# Altium schematic sheet 06 POWER.SchDoc: POWER
size 420 x 297 mm; SheetNumber: 6; SheetTotal: 6
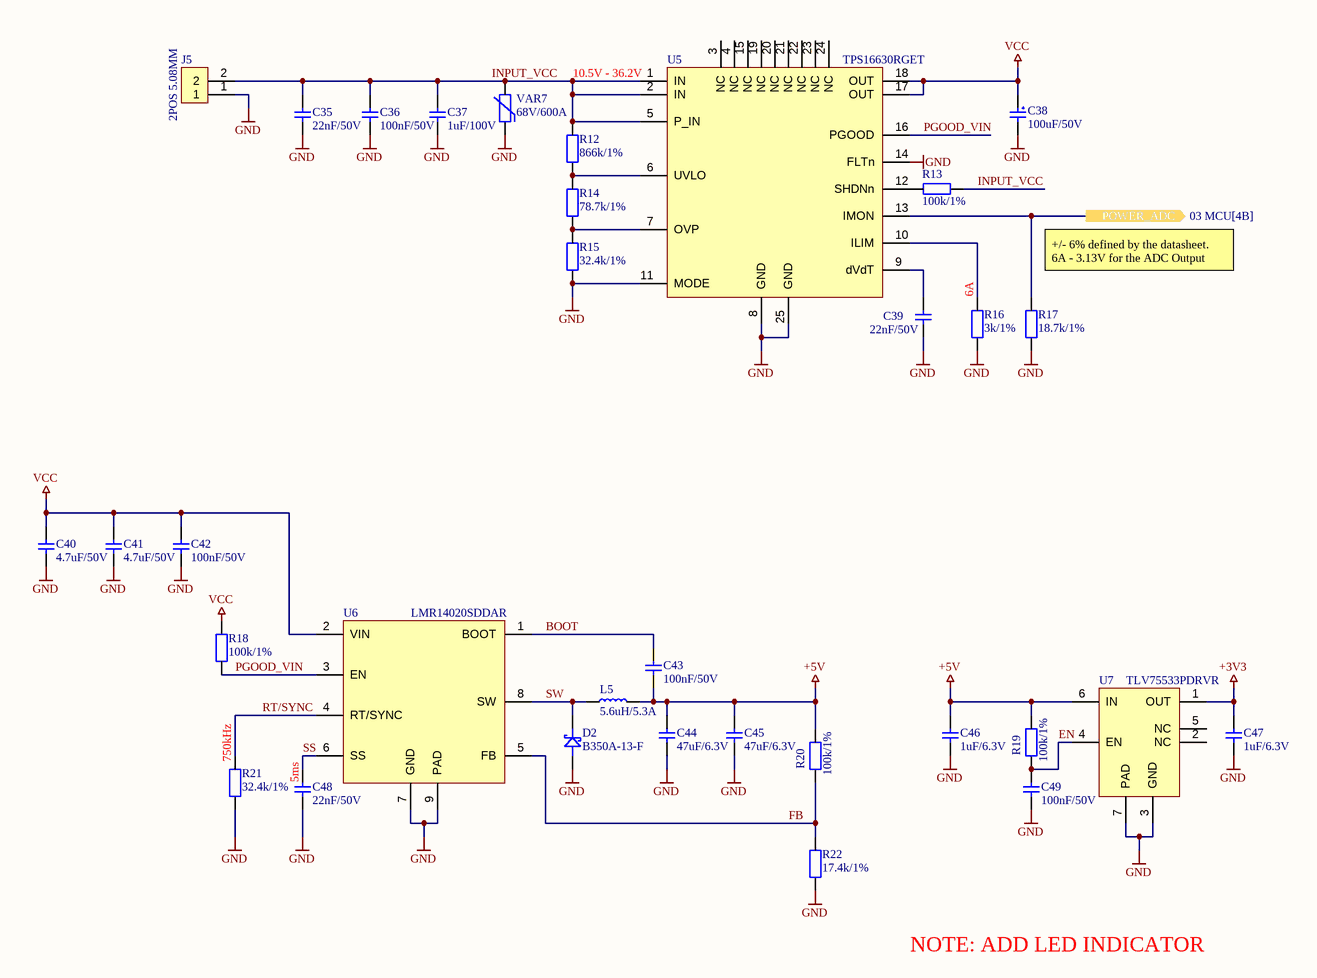
[diagram p0: 06 POWER.SchDoc]

## Parts
C35  22nF/50V  [CAPC1005X06M-0402]
C36  100nF/50V  [CAPC1005X06M-0402]
C37  1uF/100V  [CAPC2012X14M]
C38  100uF/50V  [A768KS107M1HLAE030]
C39  22nF/50V  [CAPC1005X06M-0402]
C40  4.7uF/50V  [CAPC2012X14M]
C41  4.7uF/50V  [CAPC2012X14M]
C42  100nF/50V  [CAPC1005X06M-0402]
C43  100nF/50V  [CAPC1005X06M-0402]
C44  47uF/6.3V  [CAPC1608X10M-0603]
C45  47uF/6.3V  [CAPC1608X10M-0603]
C46  1uF/6.3V  [CAPC1005X06M-0402]
C47  1uF/6.3V  [CAPC1005X06M-0402]
C48  22nF/50V  [CAPC1005X06M-0402]
C49  100nF/50V  [CAPC1005X06M-0402]
D2  B350A-13-F  [SMA]
J5  2POS 5.08MM  [282837-2]
L5  5.6uH/5.3A  [IHLP2525CZER5R6M8A]
R12  866k/1%  [RESC1005X04M-0402]
R13  100k/1%  [RESC1005X04M-0402]
R14  78.7k/1%  [RESC1005X04M-0402]
R15  32.4k/1%  [RESC1005X04M-0402]
R16  3k/1%  [RESC1005X04M-0402]
R17  18.7k/1%  [RESC1005X04M-0402]
R18  100k/1%  [RESC1005X04M-0402]
R19  100k/1%  [RESC1005X04M-0402]
R20  100k/1%  [RESC1005X04M-0402]
R21  32.4k/1%  [RESC1005X04M-0402]
R22  17.4k/1%  [RESC1005X04M-0402]
U5  TPS16630RGET  [PQFN50P400X400X100_HS-25N]
U6  LMR14020SDDAR  [SOIC127P600X170_HS-9N]
U7  TLV75533PDRVR  [SON65P200X80_HS-7N]
VAR7  68V/600A  [VARA4732X16N]

## Ports
POWER_ADC (out, see 03 MCU[4B])

## Nets
+3V3: C47.2 U7.1(OUT)
+5V: C43.1 C44.2 C45.2 C46.2 L5.2 R19.2 R20.2 U7.6(IN)
GND: C35.1 C36.1 C37.1 C38.2 C39.1 C40.1 C41.1 C42.1 C44.1 C45.1 C46.1 C47.1 C48.2 C49.1 D2.2 J5.1 R15.1 R16.1 R17.1 R21.1 R22.1 U5.8(GND) U5.11(MODE) U5.14(FLTn) U5.25(GND) U6.7(GND) U6.9(PAD) U7.3(GND) U7.7(PAD) VAR7.1
VCC: C38.1 C40.2 C41.2 C42.2 R18.1 U5.17(OUT) U5.18(OUT) U6.2(VIN)
BOOT: C43.2 U6.1(BOOT)
EN: C49.2 R19.1 U7.4(EN)
FB: R20.1 R22.2 U6.5(FB)
INPUT_VCC: C35.2 C36.2 C37.2 J5.2 R12.2 R13.1 U5.1(IN) U5.2(IN) U5.5(P_IN) VAR7.2
PGOOD_VIN: R18.2 U5.16(PGOOD) U6.3(EN)
POWER_ADC: R17.2 U5.13(IMON) ; port POWER_ADC
RT/SYNC: R21.2 U6.4(RT/SYNC)
SS: C48.1 U6.6(SS)
SW: D2.1 L5.1 U6.8(SW)
NetC39_2: C39.2 U5.9(dVdT)
NetR12_1: R12.1 R14.2 U5.6(UVLO)
NetR13_2: R13.2 U5.12(SHDNn)
NetR14_1: R14.1 R15.2 U5.7(OVP)
NetR16_2: R16.2 U5.10(ILIM)

Not connected (* = marked no-connect by the designer): U5 3(NC) 4(NC) 15(NC) 19(NC) 20(NC) 21(NC) 22(NC) 23(NC) 24(NC); U7 2(NC) 5(NC)

## Notes on the sheet
- (near U5) 10.5V - 36.2V
- (near R16) 6A
- (near R17) +/- 6% defined by the datasheet.
  6A - 3.13V for the ADC Output
- (near R21) 750kHz
- (near C48) 5ms
- NOTE: ADD LED INDICATOR
- Title
- Project
- Size
- Date
- Revision
- A3
- Designed By

## Library data of the parts
C35 C39 C48 = GRM155R71H223KA12D: 0.022 µF ±10% 50V Ceramic Capacitor X7R 0402 (1005 Metric); ComponentLink1Description: Datasheet; ComponentLink1URL: https://search.murata.co.jp/Ceramy/image/img/A01X/G101/ENG/GRM155R60J475ME47-01.pdf; MPN: GRM155R71H223KA12D
C36 C42 C43 C49 = GRM155R71H104KE14D: 0.1 µF ±10% 50V Ceramic Capacitor X7R 0402 (1005 Metric); ComponentLink1Description: Datasheet; ComponentLink1URL: https://search.murata.co.jp/Ceramy/image/img/A01X/G101/ENG/GRM155R60J475ME47-01.pdf; MPN: GRM155R71H104KE14D
C37 = GRM21BC72A105KE01L: 1 µF ±10% 100V Ceramic Capacitor X7S 0805 (2012 Metric); ComponentLink1Description: Datasheet; ComponentLink1URL: https://search.murata.co.jp/Ceramy/image/img/A01X/G101/ENG/GRM21BC72A105KE01-01.pdf; MPN: GRM21BC72A105KE01L
C38 = A768KS107M1HLAE030: 100 µF 50 V Aluminum - Polymer Capacitors Radial, Can - SMD 30mOhm 2000 Hrs @ 125°C; ComponentLink1Description: Datasheet; ComponentLink1URL: https://connect.kemet.com:7667/gateway/IntelliData-ComponentDocumentation/1.0/download/datasheet/A768KS107M1HLAE030; MPN: A768KS107M1HLAE030
C40 C41 = GRM21BR61H475KE51L: 4.7 µF ±10% 50V Ceramic Capacitor X5R 0805 (2012 Metric); ComponentLink1Description: Datasheet; ComponentLink1URL: https://search.murata.co.jp/Ceramy/image/img/A01X/G101/ENG/GRM21BC72A105KE01-01.pdf; MPN: GRM21BR61H475KE51L
C44 C45 = GRM188R60J476ME15D: 47 µF ±20% 6.3V Ceramic Capacitor X5R 0603 (1608 Metric); ComponentLink1Description: Datasheet; ComponentLink1URL: https://search.murata.co.jp/Ceramy/image/img/A01X/G101/ENG/GRM188R60J476ME15-01.pdf; MPN: GRM188R60J476ME15D
C46 C47 = GRM155R70J105KA12J: 1 µF ±10% 6.3V Ceramic Capacitor X7R 0402 (1005 Metric); ComponentLink1Description: Datasheet; ComponentLink1URL: https://search.murata.co.jp/Ceramy/image/img/A01X/G101/ENG/GRM155R60J475ME47-01.pdf; MPN: GRM155R70J105KA12J
D2 = B350A-13-F: Diode 50 V 3A Surface Mount SMA; ComponentLink1Description: Datasheet; ComponentLink1URL: https://www.diodes.com/assets/Datasheets/ds30891.pdf; MPN: B350A-13-F
J5 = 282837-2: MPN: 282834-3; ComponentLink1Description: Datasheet; ComponentLink1URL: https://www.te.com/commerce/DocumentDelivery/DDEController?Action=srchrtrv&DocNm=282834&DocType=Customer+Drawing&DocLang=English
L5 = IHLP2525CZER5R6M8A: 5.6 µH Shielded Molded Inductor 5.3 A 45.6mOhm Max Nonstandard; ComponentLink1Description: Datasheet; ComponentLink1URL: https://www.vishay.com/docs/34362/lp25cz8a.pdf; MPN: IHLP2525CZER5R6M8A
R12 = RC0402FR-07866KL: 866 kOhms ±1% 0.063W, 1/16W Chip Resistor 0402 (1005 Metric) Moisture Resistant Thick Film; ComponentLink1Description: Datasheet; ComponentLink1URL: https://www.yageo.com/upload/media/product/productsearch/datasheet/rchip/PYu-RC_Group_51_RoHS_L_12.pdf; MPN: RC0402FR-07866KL
R13 R18-R20 = RC0402FR-07100KL: 100 kOhms ±1% 0.063W, 1/16W Chip Resistor 0402 (1005 Metric) Moisture Resistant Thick Film; ComponentLink1Description: Datasheet; ComponentLink1URL: https://www.yageo.com/upload/media/product/productsearch/datasheet/rchip/PYu-RC_Group_51_RoHS_L_12.pdf; MPN: RC0402FR-07100KL
R14 = RC0402FR-0778K7L: 78.7 kOhms ±1% 0.063W, 1/16W Chip Resistor 0402 (1005 Metric) Moisture Resistant Thick Film; ComponentLink1Description: Datasheet; ComponentLink1URL: https://www.yageo.com/upload/media/product/productsearch/datasheet/rchip/PYu-RC_Group_51_RoHS_L_12.pdf; MPN: RC0402FR-0778K7L
R15 R21 = RC0402FR-0732K4L: 32.4 kOhms ±1% 0.063W, 1/16W Chip Resistor 0402 (1005 Metric) Moisture Resistant Thick Film; MPN: RC0402FR-0718K7L; ComponentLink1Description: Datasheet; ComponentLink1URL: https://www.yageo.com/upload/media/product/productsearch/datasheet/rchip/PYu-RC_Group_51_RoHS_L_12.pdf
R16 = RC0402FR-073KL: 3 kOhms ±1% 0.063W, 1/16W Chip Resistor 0402 (1005 Metric) Moisture Resistant Thick Film; ComponentLink1Description: Datasheet; ComponentLink1URL: https://www.yageo.com/upload/media/product/productsearch/datasheet/rchip/PYu-RC_Group_51_RoHS_L_12.pdf; MPN: RC0402FR-073KL
R17 = RC0402FR-0718K7L: 18.7 kOhms ±1% 0.063W, 1/16W Chip Resistor 0402 (1005 Metric) Moisture Resistant Thick Film; ComponentLink1Description: Datasheet; ComponentLink1URL: https://www.yageo.com/upload/media/product/productsearch/datasheet/rchip/PYu-RC_Group_51_RoHS_L_12.pdf; MPN: RC0402FR-0718K7L
R22 = RC0402FR-0717K4L: 17.4 kOhms ±1% 0.063W, 1/16W Chip Resistor 0402 (1005 Metric) Moisture Resistant Thick Film; ComponentLink1Description: Datasheet; ComponentLink1URL: https://www.yageo.com/upload/media/product/productsearch/datasheet/rchip/PYu-RC_Group_51_RoHS_L_12.pdf; MPN: RC0402FR-0717K4L
U5 = TPS16630RGET: Electronic Fuse Regulator 6A 24-VQFN (4x4); ComponentLink1Description: Datasheet; ComponentLink1URL: https://www.ti.com/general/docs/suppproductinfo.tsp?distId=10&gotoUrl=https%3A%2F%2Fwww.ti.com%2Flit%2Fgpn%2Ftps1663; MPN: TPS16630RGET
U6 = LMR14020SDDAR: Buck Switching Regulator IC Positive Adjustable 0.8V 1 Output 2A 8-PowerSOIC (0.154", 3.90mm Width); MPN: LMR14020SDDAR; ComponentLink1Description: Datasheet; ComponentLink1URL: https://www.ti.com/general/docs/suppproductinfo.tsp?distId=10&gotoUrl=http%253A%252F%252Fwww.ti.com%252Flit%252Fgpn%252Flmr14020
U7 = TLV75533PDRVR: Linear Voltage Regulator IC Positive Fixed 1 Output 500mA 6-WSON (2x2); ComponentLink1Description: Datasheet; ComponentLink1URL: https://www.ti.com/general/docs/suppproductinfo.tsp?distId=10&gotoUrl=https%3A%2F%2Fwww.ti.com%2Flit%2Fgpn%2Ftlv755p; MPN: TLV75533PDRVR
VAR7 = ZV40K1812601NIR1: 68 V 600 A Varistor 1 Circuit Surface Mount, MLCV 1812 (4532 Metric); ComponentLink1Description: Datasheet; ComponentLink1URL: https://www.bourns.com/docs/Product-Datasheets/ZV_series.pdf; MPN: ZV40K1812601NIR1